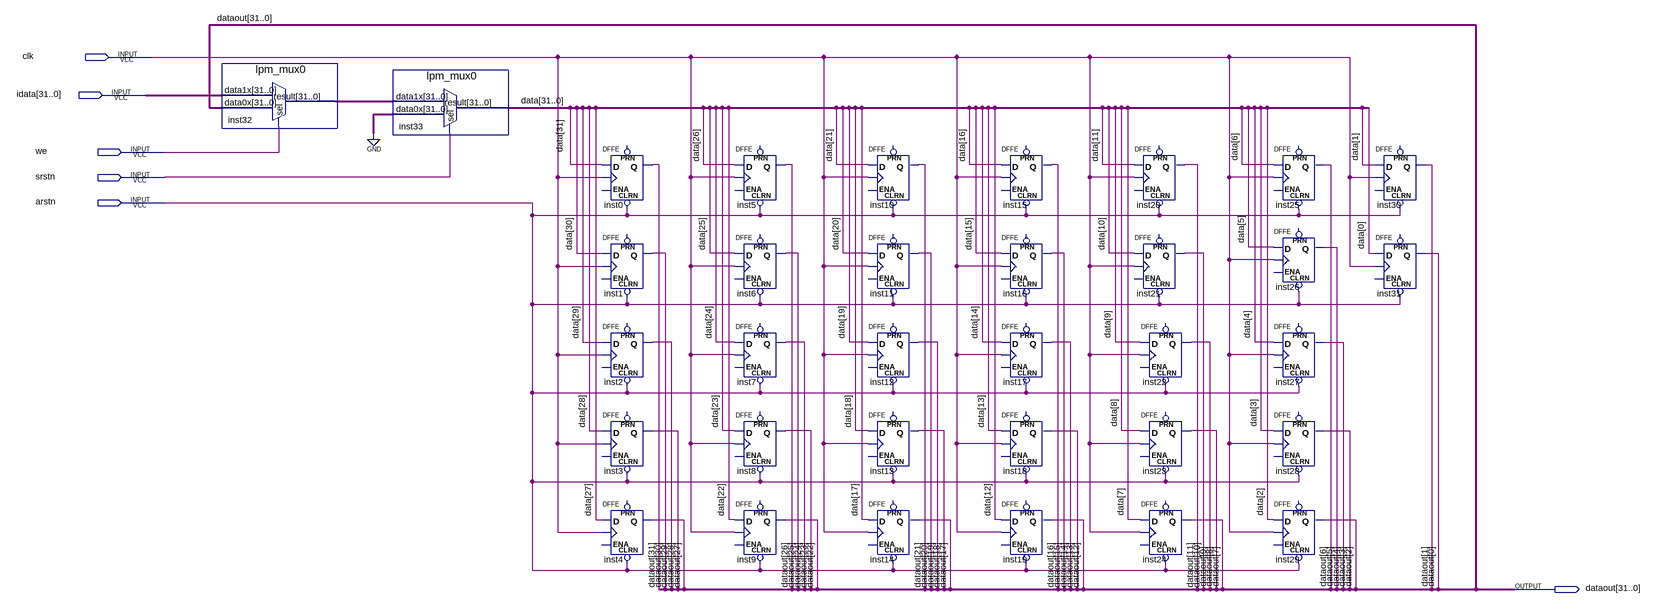
[diagram p0: schematic sheet]
// Quartus schematic lab1.bdf as structural Verilog: 34 symbols, 6 pins
module lab1 (
  input  clk,
  input  [31:0] idata,
  input  we,
  input  srstn,
  input  arstn,
  output [31:0] dataout
);

  wire [31:0] data, inst32_result;

  lpm_mux0 inst32 (.data1x(idata), .data0x(dataout), .sel(we), .result(inst32_result));
  lpm_mux0 inst33 (.data0x({32{1'b0}}), .data1x(inst32_result), .sel(srstn), .result(data));
  DFFE inst0 (.CLRN(arstn), .D(data[31]), .CLK(clk), .Q(dataout[31]));  // open: PRN, ENA
  DFFE inst1 (.CLRN(arstn), .D(data[30]), .CLK(clk), .Q(dataout[30]));  // open: PRN, ENA
  DFFE inst2 (.CLRN(arstn), .D(data[29]), .CLK(clk), .Q(dataout[29]));  // open: PRN, ENA
  DFFE inst3 (.CLRN(arstn), .D(data[28]), .CLK(clk), .Q(dataout[28]));  // open: PRN, ENA
  DFFE inst4 (.CLRN(arstn), .D(data[27]), .CLK(clk), .Q(dataout[27]));  // open: PRN, ENA
  DFFE inst5 (.CLRN(arstn), .D(data[26]), .CLK(clk), .Q(dataout[26]));  // open: PRN, ENA
  DFFE inst6 (.CLRN(arstn), .D(data[25]), .CLK(clk), .Q(dataout[25]));  // open: PRN, ENA
  DFFE inst7 (.CLRN(arstn), .D(data[24]), .CLK(clk), .Q(dataout[24]));  // open: PRN, ENA
  DFFE inst8 (.CLRN(arstn), .D(data[23]), .CLK(clk), .Q(dataout[23]));  // open: PRN, ENA
  DFFE inst9 (.CLRN(arstn), .D(data[22]), .CLK(clk), .Q(dataout[22]));  // open: PRN, ENA
  DFFE inst10 (.CLRN(arstn), .D(data[21]), .CLK(clk), .Q(dataout[21]));  // open: PRN, ENA
  DFFE inst11 (.CLRN(arstn), .D(data[20]), .CLK(clk), .Q(dataout[20]));  // open: PRN, ENA
  DFFE inst12 (.CLRN(arstn), .D(data[19]), .CLK(clk), .Q(dataout[19]));  // open: PRN, ENA
  DFFE inst13 (.CLRN(arstn), .D(data[18]), .CLK(clk), .Q(dataout[18]));  // open: PRN, ENA
  DFFE inst14 (.CLRN(arstn), .D(data[17]), .CLK(clk), .Q(dataout[17]));  // open: PRN, ENA
  DFFE inst15 (.CLRN(arstn), .D(data[16]), .CLK(clk), .Q(dataout[16]));  // open: PRN, ENA
  DFFE inst16 (.CLRN(arstn), .D(data[15]), .CLK(clk), .Q(dataout[15]));  // open: PRN, ENA
  DFFE inst17 (.CLRN(arstn), .D(data[14]), .CLK(clk), .Q(dataout[14]));  // open: PRN, ENA
  DFFE inst18 (.CLRN(arstn), .D(data[13]), .CLK(clk), .Q(dataout[13]));  // open: PRN, ENA
  DFFE inst19 (.CLRN(arstn), .D(data[12]), .CLK(clk), .Q(dataout[12]));  // open: PRN, ENA
  DFFE inst20 (.CLRN(arstn), .D(data[11]), .CLK(clk), .Q(dataout[11]));  // open: PRN, ENA
  DFFE inst21 (.CLRN(arstn), .D(data[10]), .CLK(clk), .Q(dataout[10]));  // open: PRN, ENA
  DFFE inst22 (.CLRN(arstn), .D(data[9]), .CLK(clk), .Q(dataout[9]));  // open: PRN, ENA
  DFFE inst23 (.CLRN(arstn), .D(data[8]), .CLK(clk), .Q(dataout[8]));  // open: PRN, ENA
  DFFE inst24 (.CLRN(arstn), .D(data[7]), .CLK(clk), .Q(dataout[7]));  // open: PRN, ENA
  DFFE inst25 (.CLRN(arstn), .D(data[6]), .CLK(clk), .Q(dataout[6]));  // open: PRN, ENA
  DFFE inst26 (.CLRN(arstn), .D(data[5]), .CLK(clk), .Q(dataout[5]));  // open: PRN, ENA
  DFFE inst27 (.CLRN(arstn), .D(data[4]), .CLK(clk), .Q(dataout[4]));  // open: PRN, ENA
  DFFE inst28 (.CLRN(arstn), .D(data[3]), .CLK(clk), .Q(dataout[3]));  // open: PRN, ENA
  DFFE inst29 (.CLRN(arstn), .D(data[2]), .CLK(clk), .Q(dataout[2]));  // open: PRN, ENA
  DFFE inst30 (.CLRN(arstn), .D(data[1]), .CLK(clk), .Q(dataout[1]));  // open: PRN, ENA
  DFFE inst31 (.CLRN(arstn), .D(data[0]), .CLK(clk), .Q(dataout[0]));  // open: PRN, ENA
endmodule
